# EAGLE design pcb_univ_3-102-0-x-rev3 (EAGLE 5.11)
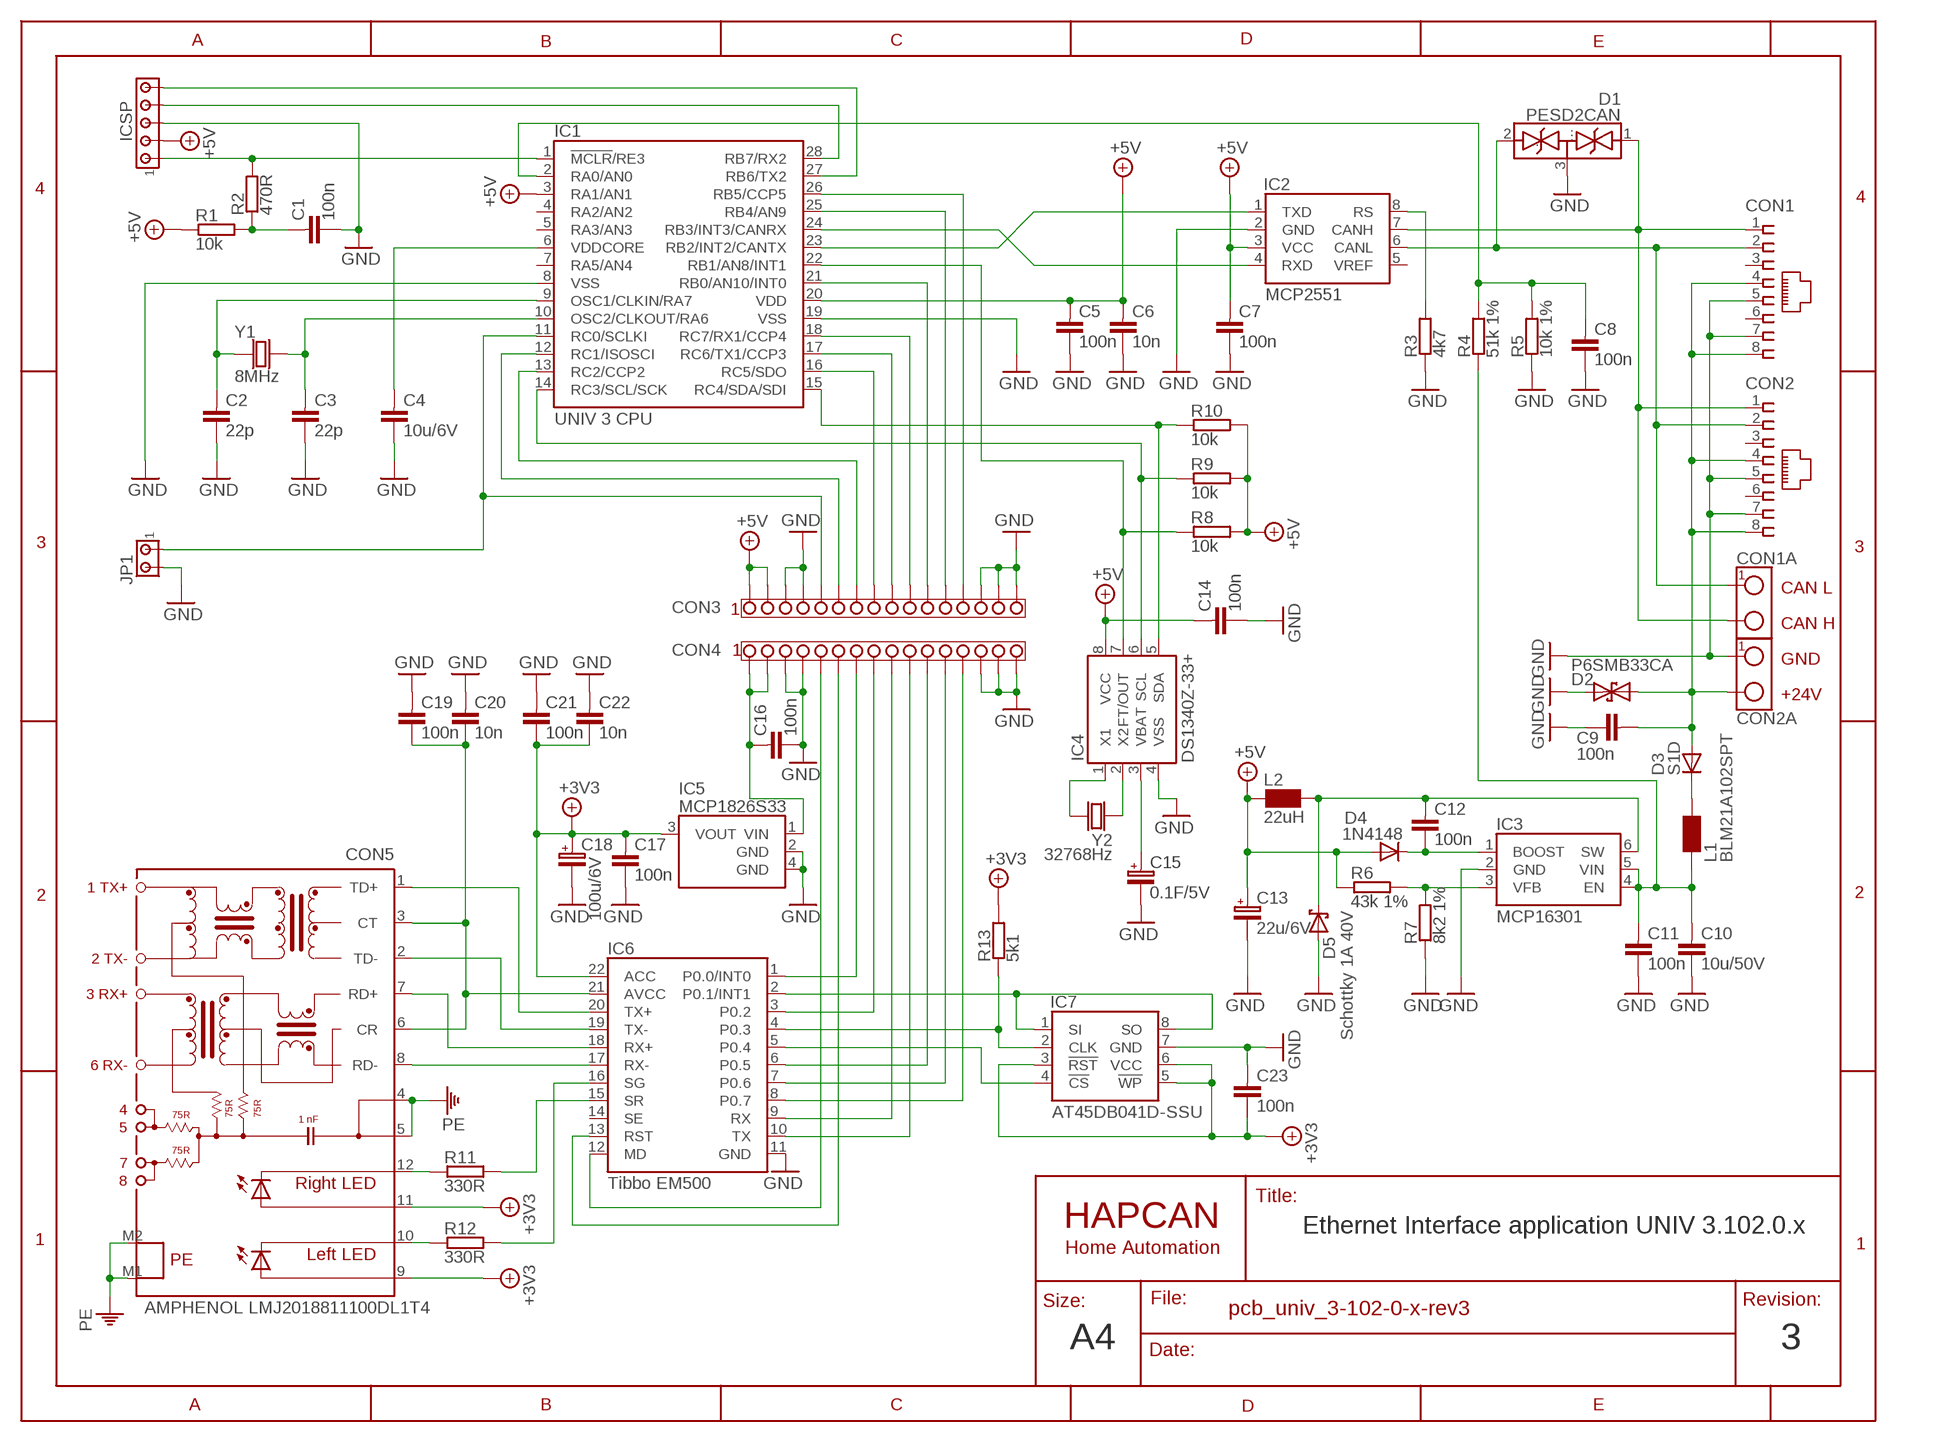
[diagram p0: schematic, sheet 1]

## Parts
C1  100n  CAPACITOR0805  [0805]
C2  22p  CAPACITOR0805  [0805]
C3  22p  CAPACITOR0805  [0805]
C4  10u/6V  CAPACITOR0805  [0805]
C5  100n  CAPACITOR0805  [0805]
C6  10n  CAPACITOR0805  [0805]
C7  100n  CAPACITOR0805  [0805]
C8  100n  CAPACITOR0805  [0805]
C9  100n  CAPACITOR0805  [0805]
C10  10u/50V  CAPACITOR1210  [1210]
C11  100n  CAPACITOR0805  [0805]
C12  100n  CAPACITOR0805  [0805]
C13  22u/6V  CAPACITOR-POLARIZED-SMC_B  [SMC_B]
C14  100n  CAPACITOR0805  [0805]
C15  0.1F/5V  CAPACITOR-POLARIZED-5X14  [CAP-5X14]
C16  100n  CAPACITOR0805  [0805]
C17  100n  CAPACITOR0805  [0805]
C18  100u/6V  CAPACITOR-POLARIZED-SMC_B  [SMC_B]
C19  100n  CAPACITOR0805  [0805]
C20  10n  CAPACITOR0805  [0805]
C21  100n  CAPACITOR0805  [0805]
C22  10n  CAPACITOR0805  [0805]
C23  100n  CAPACITOR0805  [0805]
CON1  RJ45-SOCKET  [RJ45-PCB-SOCKET]
CON1A  TERMINAL-2  TERMINAL-2-5X10,5MM  [ARK2-5X10,5MM]
CON2  RJ45-SOCKET  [RJ45-PCB-SOCKET]
CON2A  TERMINAL-2  TERMINAL-2-5X10,5MM  [ARK2-5X10,5MM]
CON3  16pin  CONNECTOR-16PINNORMAL  [CONNECTOR-16PIN]
CON4  16pin  CONNECTOR-16PINMIRRORED  [CONNECTOR-16PIN-REVERSED]
CON5  AMPHENOL LMJ2018811100DL1T4  RJ45-SOCKET-LMJ2018811100DL1T4  [RJ45-PCB-SOCKET+TRAFO]
D1  PESD2CAN  PESD2CANSOT-23  [SOT-23]
D2  P6SMB33CA  DIODE_TRANSIL  [DO-214_TRANSIL2]
D3  S1D  DIODE_DO-214  [DO-214]
D4  1N4148  DIODE_0805  [0805]
D5  Schottky 1A 40V  DIODE_TRANSIL1  [DO-214]
IC1  UNIV 3 CPU  UNIV3(CPU)  [UNIV3CPU]
IC2  MCP2551  [SO-08]
IC3  MCP16301  MCP16301SOT23-6  [SOT-23-6]
IC4  DS1340Z-33+  DS1340ZSO-08  [SO-08]
IC5  MCP1826S33  MCP1826SOT223-3  [SOT-223]
IC6  Tibbo EM500  EM500EM500  [EM500]
IC7  AT45DB041D-SSU  AT45DB041SO8  [SO-08]
ICSP  HEADER5  [SIP-5]
JP1  HEADER2  [SIP-2]
L1  BLM21A102SPT  CHOKE0805  [0805]
L2  22uH  CHOKEDL16  [CHOKE-DL16]
R1  10k  RESISTOR0805  [0805]
R2  470R  RESISTOR0805  [0805]
R3  4k7  RESISTOR0805  [0805]
R4  51k 1%  RESISTOR0805  [0805]
R5  10k 1%  RESISTOR0805  [0805]
R6  43k 1%  RESISTOR0805  [0805]
R7  8k2 1%  RESISTOR0805  [0805]
R8  10k  RESISTOR0805  [0805]
R9  10k  RESISTOR0805  [0805]
R10  10k  RESISTOR0805  [0805]
R11  330R  RESISTOR0805  [0805]
R12  330R  RESISTOR0805  [0805]
R13  5k1  RESISTOR0805  [0805]
Y1  8MHz  CRYSTALHC49V  [CRYSTAL-HC49V]
Y2  32768Hz  CRYSTALTC26H  [CRYSTAL-TC38H]

## Nets
+5V: C5.1 C6.1 C7.1 C13.+ C14.1 C17.1 C18.+ C21.2 C22.2 C23.2 CON3.1 CON3.2 CON5.9(C-L) CON5.11(C-R) D4.2(A) IC1.3(RA1/AN1) IC1.20(VDD) IC2.3(VCC) IC4.8(VCC) IC5.3(VOUT) IC6.22(ACC) IC7.3(!RST) IC7.5(!WP) IC7.6(VCC) ICSP.2 L2.1 R1.1 R6.1 R8.2 R9.2 R10.2 R13.2 ; supply symbol labelled +3V3
GND: C1.2 C2.2 C3.2 C4.2 C5.2 C6.2 C7.2 C8.2 C9.2 C10.2 C11.2 C13.- C14.2 C15.- C16.2 C17.2 C18.- C19.1 C20.1 C21.1 C22.1 C23.1 CON1.5 CON1.7 CON2.5 CON2.7 CON2A.1 CON3.3 CON3.4 CON3.14 CON3.15 CON3.16 CON4.3 CON4.4 CON4.14 CON4.15 CON4.16 D1.3(...) D2.C D5.A IC1.8(VSS) IC1.19(VSS) IC2.2(GND) IC3.2(GND) IC4.4(VSS) IC5.2(GND) IC5.4(GND) IC6.11(GND) IC7.7(GND) ICSP.3 JP1.2 R3.1 R5.1 R7.1
ICSP: IC1.1(!MCLR!/RE3) ICSP.1 R2.2
N$1: CON5.12(A-R) R11.1
N$2: IC1.24(RB3/INT3/CANRX) IC2.4(RXD)
N$3: IC1.23(RB2/INT2/CANTX) IC2.1(TXD)
N$4: CON5.10(A-L) R12.1
N$5: C12.1 D5.C IC3.6(SW) L2.2
N$6: IC3.3(VFB) R6.2 R7.2
N$7: C1.1 R1.2 R2.1
N$8: C8.1 IC1.2(RA0/AN0) R4.2 R5.2
N$9: CON1.1 CON1A.2 CON2.1 D1.1(.) IC2.7(CANH)
N$10: IC1.28(RB7/RX2) ICSP.4
N$11: C2.1 IC1.9(OSC1/CLKIN/RA7) Y1.1
N$12: IC2.8(RS) R3.2
N$13: CON1.2 CON1A.1 CON2.2 D1.2(..) IC2.6(CANL)
N$14: IC1.27(RB6/TX2) ICSP.5
N$15: C3.1 IC1.10(OSC2/CLKOUT/RA6) Y1.2
N$16: CON3.5 IC1.11(RC0/SCLKI) JP1.1
N$17: IC1.15(RC4/SDA/SDI) IC4.5(SDA) R10.1
N$18: C10.1 C11.1 IC3.4(EN) IC3.5(VIN) L1.1 R4.1
N$19: IC4.2(X2) Y2.1
N$20: IC6.16(SG) R12.2
N$21: IC6.15(SR) R11.2
N$22: C19.2 C20.2 CON5.3(CT) CON5.6(CR) IC6.21(AVCC)
N$23: CON5.7(RD+) IC6.18(RX+)
N$24: CON5.1(TD+) IC6.20(TX+)
N$25: CON5.8(RD-) IC6.17(RX-)
N$26: CON5.2(TD-) IC6.19(TX-)
N$27: CON4.5 IC6.12(MD)
N$28: C16.1 CON4.1 CON4.2 IC5.1(VIN)
N$29: CON3.9 IC1.17(RC6/TX1/CCP3)
N$30: CON3.8 IC1.16(RC5/SDO)
N$31: CON4.6 IC6.13(RST)
N$32: CON3.7 IC1.13(RC2/CCP2)
N$33: CON3.10 IC1.18(RC7/RX1/CCP4)
N$34: IC6.5(P0.4) IC7.4(!CS)
N$35: IC6.4(P0.3) IC7.2(CLK) R13.1
N$36: CON4.7 IC6.1(P0.0/INT0)
N$37: IC6.2(P0.1/INT1) IC7.1(SI) IC7.8(SO)
N$38: C12.2 D4.1(C) IC3.1(BOOST)
N$39: IC1.14(RC3/SCL/SCK) IC4.6(SCL) R9.1
N$40: CON4.8 IC6.3(P0.2)
N$41: CON4.9 IC6.9(RX)
N$42: CON4.10 IC6.10(TX)
N$43: CON4.11 IC6.6(P0.5)
N$44: CON4.12 IC6.7(P0.6)
N$45: CON4.13 IC6.8(P0.7)
N$47: CON3.6 IC1.12(RC1/ISOSCI)
N$49: IC4.1(X1) Y2.2
N$50: C15.+ IC4.3(VBAT)
N$51: CON3.11 IC1.21(RB0/AN10/INT0)
N$52: CON3.13 IC1.26(RB5/CCP5)
N$54: CON3.12 IC1.25(RB4/AN9)
N$55: IC1.22(RB1/AN8/INT1) IC4.7(FT/OUT) R8.1
N$56: C4.1 IC1.6(VDDCORE)
N$59: C9.1 CON1.4 CON1.8 CON2.4 CON2.8 CON2A.2 D2.A D3.A
N$61: D3.C L1.2
PE: CON5.4 CON5.5 CON5.M1 CON5.M2
Unconnected: CON1.3 CON1.6 CON2.3 CON2.6 IC1.4(RA2/AN2) IC1.5(RA3/AN3) IC1.7(RA5/AN4) IC2.5(VREF) IC6.14(SE)

## Notes on the sheet
- CAN L
- CON3 | 1
- CAN H
- CON4 | 1
- GND
- +24V
- Ethernet Interface application UNIV 3.102.0.x
- A4 | 3

## Library data of the parts
C1-C12 C14 C16 C17 C19-C23 = HAPCAN_devices - UNIV3:CAPACITOR: HAPCAN Capacitor
C13 C15 C18 = HAPCAN_devices - UNIV3:CAPACITOR-POLARIZED: HAPCAN Polarazied Capacitor
CON1 CON2 = HAPCAN_devices - UNIV3:RJ45-SOCKET: HAPCAN RJ45 socket
CON1A CON2A = HAPCAN_devices - UNIV3:TERMINAL-2: HAPCAN Terminal Block - 2 way
CON3 CON4 = HAPCAN_devices - UNIV3:CONNECTOR-16PIN: 16pin connector 2.54 raster
CON5 = HAPCAN_devices - UNIV3:RJ45-SOCKET-LMJ2018811100DL1T4: AMPHENOL LMJ2018811100DL1T4
D1 = HAPCAN_devices - UNIV3:PESD2CAN: CAN bus ESD protection diode
D2 = HAPCAN_devices - UNIV3:DIODE_TRANSIL: Transil diode
D3 D4 = HAPCAN_devices - UNIV3:DIODE: HAPCAN Rectifier Diode
D5 = HAPCAN_devices - UNIV3:DIODE_TRANSIL1: HAPCAN Unidirectional transil diode
IC1 = HAPCAN_devices - UNIV3:UNIV3(CPU): HAPCAN Microcontroller UNIV 3 (CPU)
IC2 = HAPCAN_devices - UNIV3:MCP2551: HAPCAN CAN Tranceiver
IC3 = HAPCAN_devices - UNIV3:MCP16301: High Voltage Input Integrated Switch Step-Down Regulator
IC4 = HAPCAN_devices - UNIV3:DS1340Z: DS1340Z
IC5 = HAPCAN_devices - UNIV3:MCP1826: 1000 mA, Low Voltage, Low Quiescent Current LDO Regulator
IC6 = HAPCAN_devices - UNIV3:EM500: Tibbo programmable ethernet module
IC7 = HAPCAN_devices - UNIV3:AT45DB041
ICSP = HAPCAN_devices - UNIV3:HEADER5: HAPCAN Header 5
JP1 = HAPCAN_devices - UNIV3:HEADER2: HAPCAN Header 2
L1 L2 = HAPCAN_devices - UNIV3:CHOKE: Choke
R1-R13 = HAPCAN_devices - UNIV3:RESISTOR: HAPCAN Resistor
Y1 Y2 = HAPCAN_devices - UNIV3:CRYSTAL: HAPCAN Crystal

## Board
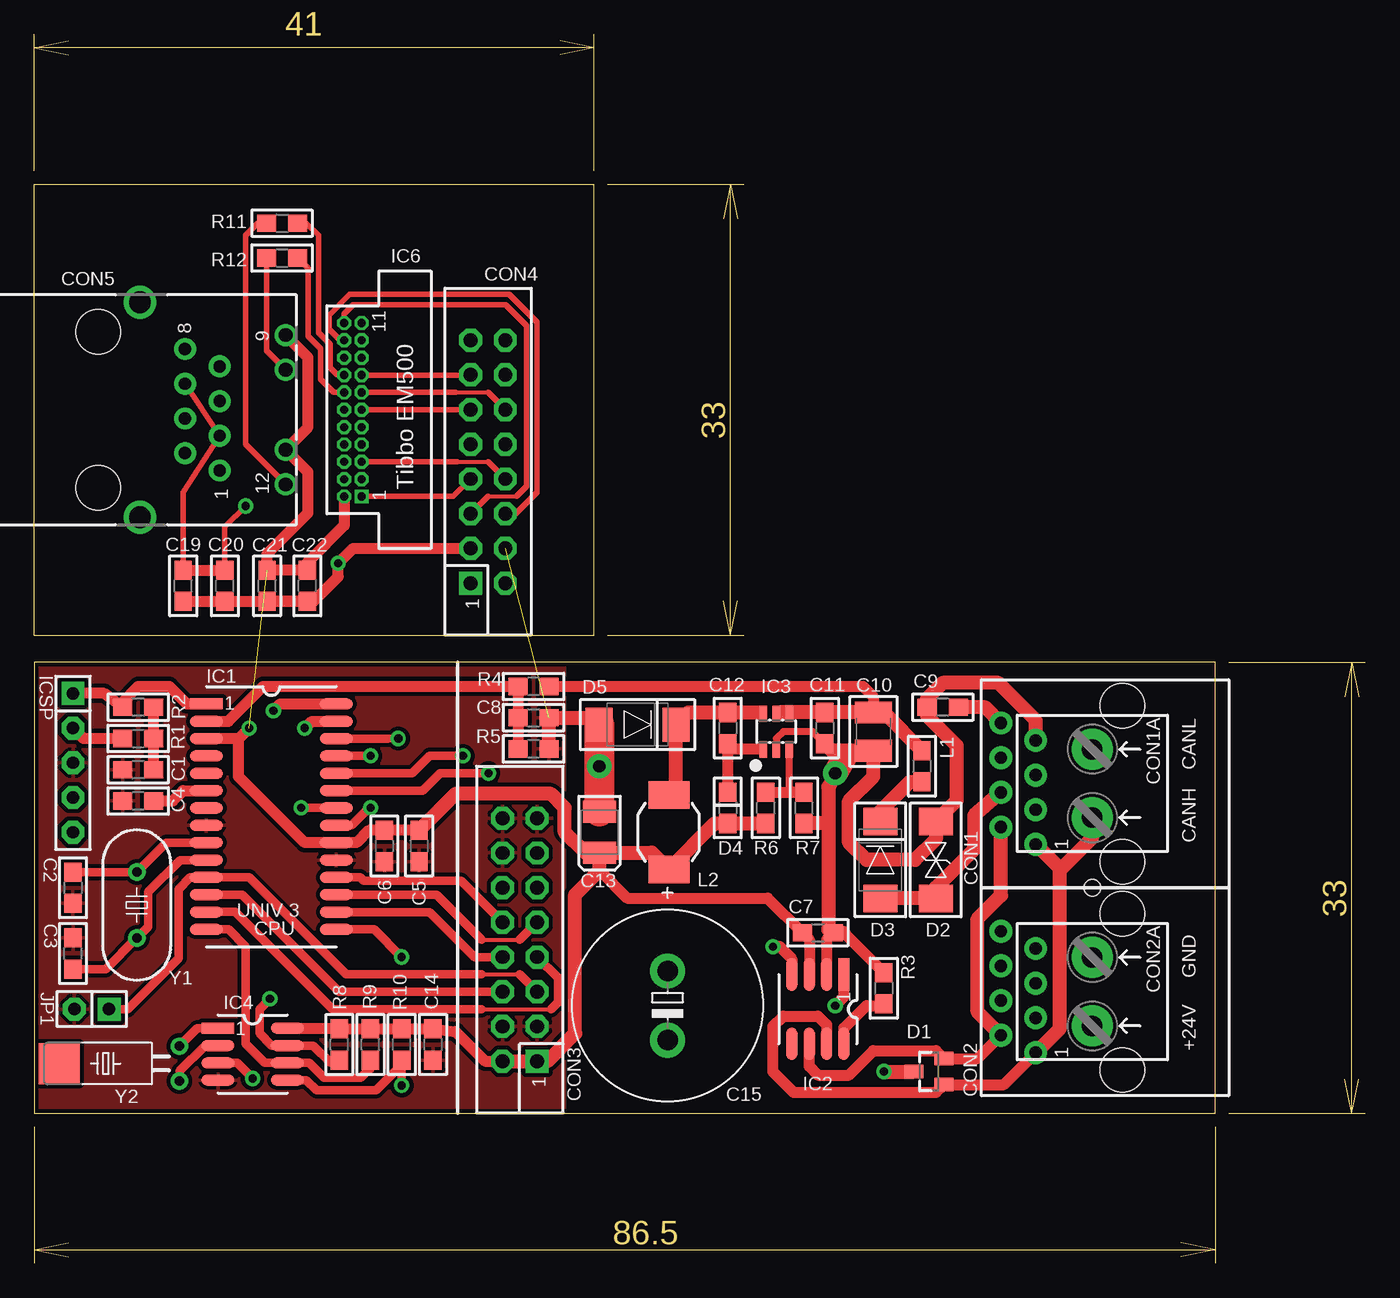
[diagram p1: board, top side]
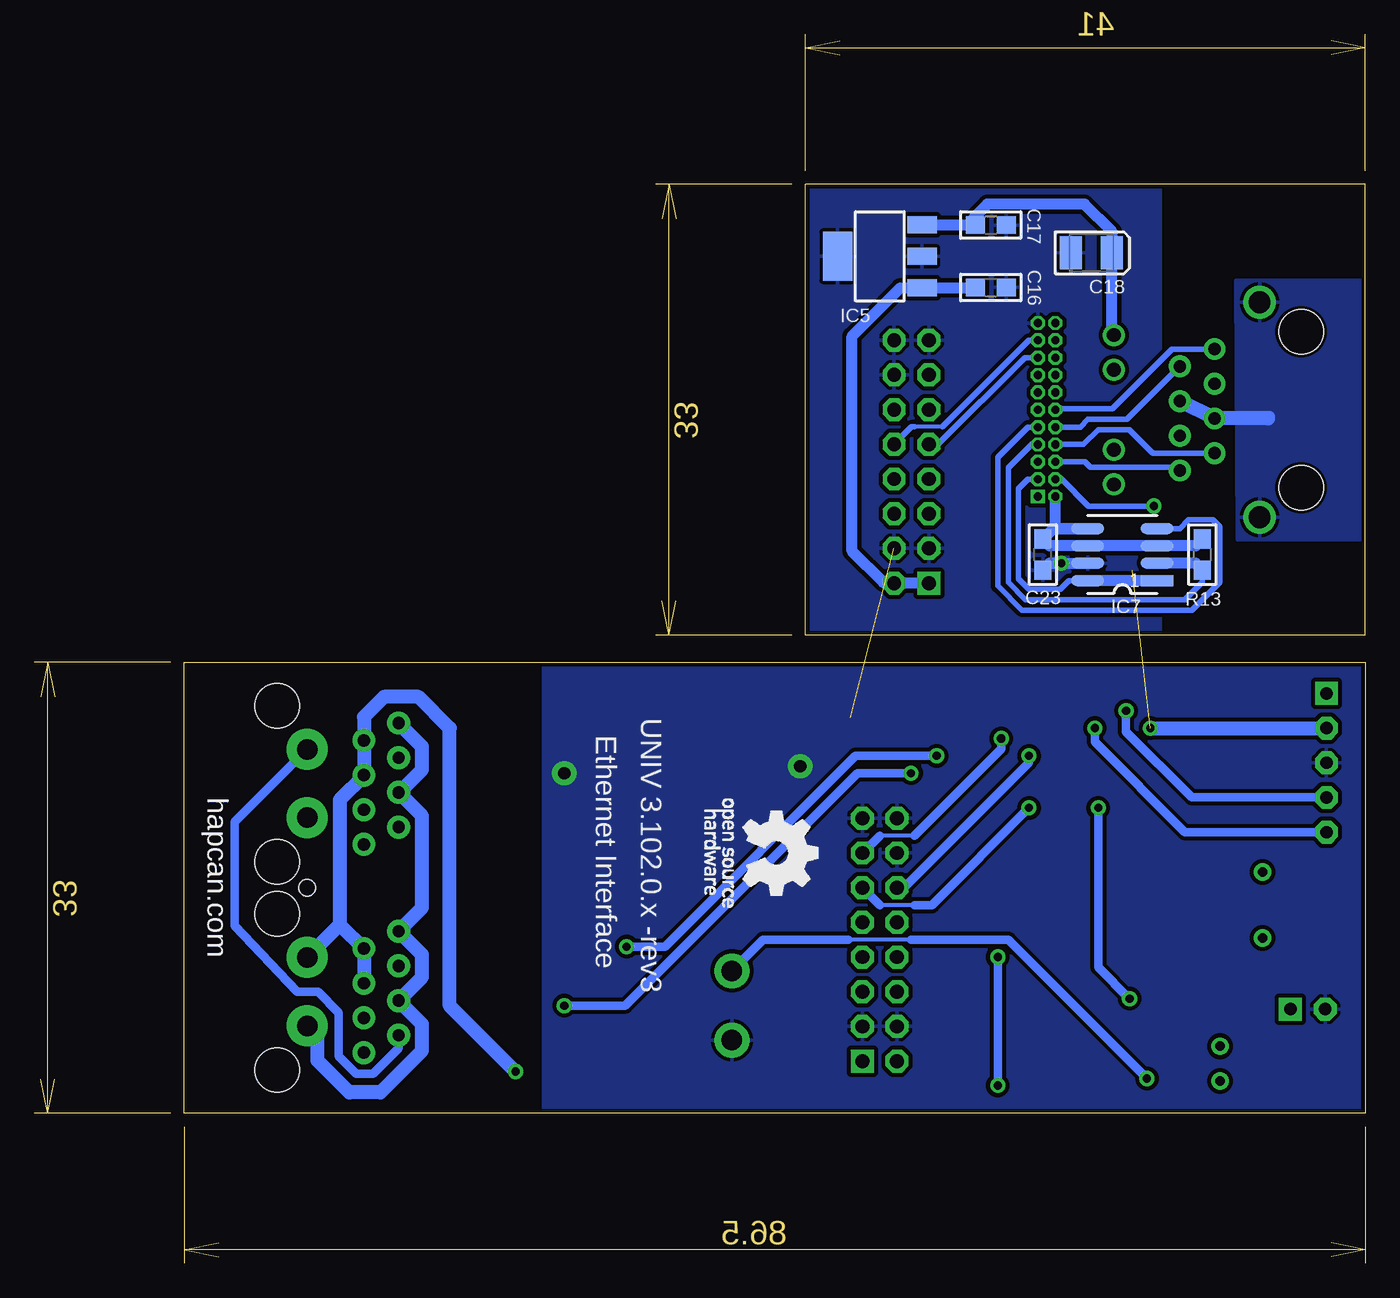
[diagram p2: board, bottom side, seen from below]

Size 97.5 x 90 mm. Coordinates in mm from the lower left corner, seen from the top.
Outline: 0,10 0,1
Outline: 0,1 0,0
Outline: 86.5,10 86.5,1
Outline: 86.5,1 86.5,0
Outline: 0,1 86.5,1
Outline: 86.5,1 84,1.5
Outline: 86.5,1 84,0.5
Outline: 0,1 2.5,1.5
Outline: 0,1 2.5,0.5
Outline: 41,80 41,89
Outline: 41,89 41,90
Outline: 0,80 0,89
Outline: 0,89 0,90
Outline: 41,89 0,89
Outline: 0,89 2.5,88.5
Outline: 0,89 2.5,89.5
Outline: 41,89 38.5,88.5
Outline: 41,89 38.5,89.5
Outline: 42,46 51,46
Outline: 51,46 52,46
Outline: 42,79 51,79
Outline: 51,79 52,79
Outline: 51,46 51,79
Outline: 51,79 50.5,76.5
Outline: 51,79 51.5,76.5
Outline: 51,46 50.5,48.5
Outline: 51,46 51.5,48.5
Outline: 87.5,11 96.5,11
Outline: 96.5,11 97.5,11
Outline: 87.5,44 96.5,44
Outline: 96.5,44 97.5,44
Outline: 96.5,11 96.5,44
Outline: 96.5,44 96,41.5
Outline: 96.5,44 97,41.5
Outline: 96.5,11 96,13.5
Outline: 96.5,11 97,13.5
Outline: 86.5,11 86.5,44 0,44 0,11 86.5,11
Outline: 0,46 41,46 41,79 0,79 0,46
Copper layers (1*16): Top 0.035mm / dielectric 1.5mm / Bottom 0.035mm
Design rules "HAPCAN-Drc *": minimum track width 10mil, minimum drill 0.5mm, track to track 10mil, track to pad 10mil, pad to pad 10mil, via to via 10mil, smd to smd 0mil, copper to edge 10mil, drill to drill 8mil, minimum pad ring 8mil, minimum via ring 10mil, stop-mask expansion 4mil, vias tented up to drill 0mil, thermal gap 10mil
Holes 1.2 mm at 77.5,27.5
tKeepout: 4 lines

### Footprints (pad centres in the part's own frame; a part is rotated, then mirrored left to right if it is on the bottom)
0805 = smd 1.397 x 1.27: 1 -1.143,0; 2 1.143,0
1210 = smd 1.6 x 2.7: 1 -1.4,0; 2 1.4,0
SMC_B = smd 1.6 x 2.4: + -1.5,0; - 1.5,0
CAP-5X14 = drill 1.5 pad 2.54 round: + -2.54,0; - 2.54,0
RJ45-PCB-SOCKET@1 = drill 0.9 pad 1.676 round: 1 -4.445,6.35; 2 -3.175,8.89; 3 -1.905,6.35; 4 -0.635,8.89; 5 0.635,6.35; 6 1.905,8.89; 7 3.175,6.35; 8 4.445,8.89 | hole 3.251: -5.715,0; 5.715,0
ARK2-5X10,5MM = drill 1.5 pad 3 round: 1 -2.5,0; 2 2.5,0
CONNECTOR-16PIN = drill 1.016 pad 1.676 square: 1 -8.89,-1.27 | drill 1.016 pad 1.676 octagon: 2 -8.89,1.27; 3 -6.35,-1.27; 4 -6.35,1.27; 5 -3.81,-1.27; 6 -3.81,1.27; 7 -1.27,-1.27; 8 -1.27,1.27; 9 1.27,-1.27; 10 1.27,1.27; 11 3.81,-1.27; 12 3.81,1.27; 13 6.35,-1.27; 14 6.35,1.27; 15 8.89,-1.27; 16 8.89,1.27
CONNECTOR-16PIN-REVERSED = drill 1.016 pad 1.676 square: 1 -8.89,1.27 | drill 1.016 pad 1.676 octagon: 2 -8.89,-1.27; 3 -6.35,1.27; 4 -6.35,-1.27; 5 -3.81,1.27; 6 -3.81,-1.27; 7 -1.27,1.27; 8 -1.27,-1.27; 9 1.27,1.27; 10 1.27,-1.27; 11 3.81,1.27; 12 3.81,-1.27; 13 6.35,1.27; 14 6.35,-1.27; 15 8.89,1.27; 16 8.89,-1.27
RJ45-PCB-SOCKET+TRAFO = drill 0.9 pad 1.6 round: 1 4.445,6.35; 2 3.175,3.81; 3 1.905,6.35; 4 0.635,3.81; 5 -0.635,6.35; 6 -1.905,3.81; 7 -3.175,6.35; 8 -4.445,3.81 | drill 1 pad 1.6 round: 9 -5.465,11.18; 10 -2.925,11.18; 11 2.925,11.18; 12 5.465,11.18 | drill 1.6 pad 2.3 round: M1 -7.875,0.51; M2 7.875,0.51 | hole 3.25: 5.715,-2.54; -5.715,-2.54
SOT-23 = smd 1 x 1.4: 1 -0.95,-1.1; 2 0.95,-1.1; 3 0,1.1
DO-214_TRANSIL2@1 = smd 2 x 2.5: A 2.82,0; C -2.82,0
DO-214 = smd 2 x 2.5: A 2.82,0; C -2.82,0
UNIV3CPU@1 = smd 2.4 x 0.8: 1 -4.763,8.255; 2 -4.763,6.985; 3 -4.763,5.715; 4 -4.763,4.445; 5 -4.763,3.175; 6 -4.763,1.905; 7 -4.763,0.635; 8 -4.763,-0.635; 9 -4.763,-1.905; 10 -4.763,-3.175; 11 -4.763,-4.445; 12 -4.763,-5.715; 13 -4.763,-6.985; 14 -4.763,-8.255; 15 4.763,-8.255; 16 4.763,-6.985; 17 4.763,-5.715; 18 4.763,-4.445; 19 4.763,-3.175; 20 4.763,-1.905; 21 4.763,-0.635; 22 4.763,0.635; 23 4.763,1.905; 24 4.763,3.175; 25 4.763,4.445; 26 4.763,5.715; 27 4.763,6.985; 28 4.763,8.255
SO-08 = smd 2.4 x 0.8: 1 -2.54,1.905; 2 -2.54,0.635; 3 -2.54,-0.635; 4 -2.54,-1.905; 5 2.54,-1.905; 6 2.54,-0.635; 7 2.54,0.635; 8 2.54,1.905
SOT-23-6 = smd 0.55 x 1.2: 1 -0.95,-1.3; 2 0,-1.3; 3 0.95,-1.3; 4 0.95,1.3; 5 0.003,1.3; 6 -0.95,1.3
SOT-223 = smd 1.27 x 2.159: 1 -2.311,-3.099; 2 0,-3.099; 3 2.311,-3.099 | smd 3.556 x 2.159: 4 0,3.099
EM500 = drill 0.6 pad 1.016 square: 1 -6.35,1.27 | drill 0.6 pad 1.016 octagon: 2 -5.08,1.27; 3 -3.81,1.27; 4 -2.54,1.27; 5 -1.27,1.27; 6 0,1.27; 7 1.27,1.27; 8 2.54,1.27; 9 3.81,1.27; 10 5.08,1.27; 11 6.35,1.27; 12 6.35,2.54; 13 5.08,2.54; 14 3.81,2.54; 15 2.54,2.54; 16 1.27,2.54; 17 0,2.54; 18 -1.27,2.54; 19 -2.54,2.54; 20 -3.81,2.54; 21 -5.08,2.54; 22 -6.35,2.54
SIP-5 = drill 0.9 pad 1.676 square: 1 -5.08,0 | drill 0.9 pad 1.676 octagon: 2 -2.54,0; 3 0,0; 4 2.54,0; 5 5.08,0
SIP-2 = drill 0.9 pad 1.676 square: 1 -1.27,0 | drill 0.9 pad 1.676 octagon: 2 1.27,0
CHOKE-DL16 = smd 2 x 3: 1 -2.73,0; 2 2.73,0
CRYSTAL-HC49V = drill 0.7 pad 1.27 round: 1 -2.413,0; 2 2.413,0
CRYSTAL-TC38H = drill 0.7 pad 1.27 round: 1 -1.27,-5; 2 1.27,-5 | smd 3 x 3: 3 0,3.8

### Placement (x,y rotation side)
C1  7.62,36.15 180 top
C2  2.84,27.51 270 top
C3  2.84,22.69 90 top
C4  7.62,33.86 180 top
C5  28.19,30.56 270 top
C6  25.65,30.56 270 top
C7  57.4,24.21 0 top
C8  36.58,39.96 0 top
C9  66.55,40.72 180 top
C10  61.47,38.94 270 top
C11  57.91,39.19 270 top
C12  50.8,39.19 270 top
C13  41.4,31.57 90 top
C14  29.21,16.03 270 top
C15  46.39,18.88 270 top
C16  27.43,71.45 0 bottom
C17  27.43,76.02 0 bottom
C18  20.07,73.99 180 bottom
C19  10.92,49.61 90 top
C20  13.97,49.61 90 top
C21  17.07,49.61 90 top
C22  20.02,49.61 90 top
C23  23.62,51.89 90 bottom
CON1  [RJ45-PCB-SOCKET@1]  79.7,35.12 90 top
CON1A  77.5,35.14 270 top
CON2  [RJ45-PCB-SOCKET@1]  79.7,19.88 90 top
CON2A  77.5,19.9 270 top
CON3  35.57,23.7 90 top
CON4  33.24,58.7 90 top
CON5  7.24,62.5 270 top
D1  65.53,14.05 90 top
D2  P6SMB33CA  [DO-214_TRANSIL2@1]  66.04,29.54 270 top
D3  61.98,29.54 270 top
D4  50.8,33.35 270 top
D5  44.2,39.45 180 top
IC1  UNIV 3 CPU  [UNIV3CPU@1]  17.37,32.71 0 top
IC2  57.4,18.62 270 top
IC3  54.36,38.94 0 top
IC4  16,15.32 0 top
IC5  35.56,73.74 90 bottom
IC6  25.25,62.5 90 top
IC7  17.79,51.9 180 bottom
ICSP  2.84,36.65 270 top
JP1  4.22,18.62 180 top
L1  65.02,36.4 270 top
L2  46.48,31.57 90 top
R1  7.62,38.43 0 top
R2  7.62,40.72 180 top
R3  62.23,20.14 270 top
R4  36.58,42.24 180 top
R5  36.58,37.67 180 top
R6  53.59,33.35 90 top
R7  56.39,33.35 90 top
R8  22.35,16.03 90 top
R9  24.64,16.03 90 top
R10  26.92,16.03 90 top
R11  18.16,76.15 0 top
R12  18.16,73.61 0 top
R13  11.94,51.89 90 bottom
Y1  7.52,26.24 270 top
Y2  5.64,14.63 90 top

### Tracks (layer width: path | path; a pad name or v marks a point on that pad's centre or on a via)
+5V  (via drill 0.6 pad 1.02)  (1 unrouted)
  Top 0.813: R1.1 3.61,38.43 ICSP.2 | CON3.2 33.02,14.81 30.86,16.97 C14.1 R10.2 R9.2 R8.2 22.1,17.22 IC4.8 | C5.1 C6.1 24.51,31.7 23.61,30.8 IC1.20 19.82,30.8 14.98,35.65 14.98,38.42 | 14.98,38.42 IC1.3 | 14.98,38.42 v15.75,39.19 | IC2.3 56.77,23.7 C7.1 53.72,26.75 43.43,26.75 41.4,28.78 | CON5.9 20.07,66.32 20.07,61.22 CON5.11 20.07,57.93 20.07,54.94 17.07,51.94 C21.2 | C21.2 C22.2 20.07,50.8 20.07,51.39 22.71,54.03 IC6.22 | C21.2 17.07,50.8
  Top 1.016: R6.1 D4.2 49.85,32.21 L2.1 45.25,30.07 C13.+ | C5.1 30.86,34.37 37.85,34.37 38.86,33.35 38.86,31.57 40.39,30.05 41.38,30.05 C13.+ | C13.+ 41.4,28.78 39.62,27 39.62,16.84 37.59,14.81 CON3.1 CON3.2
  Bottom 0.813: IC5.3 32.49,76.05 32.51,76.02 C17.1 28.57,76.53 28.7,76.53 27.69,77.55 20.57,77.55 18.54,75.52 18.54,74.02 C18.+ 18.57,68.11 CON5.9 | R13.2 12.44,52.53 IC7.3 IC7.6 23.12,52.53 C23.2 22.86,53.8 IC7.5 22.71,53.8 IC6.22
  Bottom 1.016: v15.75,39.19 ICSP.2
GND  (via drill 0.6 pad 1.02, 0.9 pad 1.78)  (1 unrouted)
  Top 0.508: IC3.2 54.36,38.43 54.86,38.94 57.02,38.94 C11.2
  Top 0.61: v41.4,36.4 41.01,37.3 41.01,39.82
  Top 0.813: IC2.2 58.04,23.7 C7.2 59.31,24.21 R3.1 | C19.1 C20.1 C22.1 C21.1 20.46,48.47 22.28,50.28 v22.28,51.26 23.37,52.35 CON4.3
  Top 1.016: v62.23,14.05 D1.3 | R5.1 C8.2 40.87,39.96 41.01,39.82 D5.A | CON1.7 73.35,39.76 70.61,42.5 66.55,42.5 65.41,41.35 C9.2 65.41,40.08 67.56,37.92 67.56,33.89 D2.C 66.04,31.07 64.52,29.54 60.96,29.54 59.69,30.81 59.69,33.86 61.47,35.64 C10.2 59.69,37.54 | 59.69,37.54 58.42,37.54 C11.2 | 59.31,24.21 58.42,24.21 58.17,24.46 58.17,32.08 | 58.17,32.08 58.17,34.88 v58.67,35.89 | 59.69,37.54 59.44,37.16 | R7.1 58.04,32.21 58.17,32.08
  Top 1.778: 59.44,37.16 v58.67,35.89
  Top 2.184: D5.A 41.38,33.1 C13.-
  Bottom 0.813: 22.86,51.26 IC7.7 | 22.86,51.26 23.11,51.26 C23.1 | v22.28,51.26 22.86,51.26 arc90 22.86,51.26
  Bottom 1.016: CON2.5 CON2.7 75.11,24.81 | 75.11,24.81 75.11,33.94 73.35,35.69 CON1.5 CON1.7 73.35,40.01 71.88,41.48 69.34,41.48 67.06,39.19 67.06,18.87 v62.23,14.05 | CON2A.1 75.11,24.79 75.11,24.81
  pour Top (isolate 0.305): 0,11 38.86,11 38.86,44.02 0,44.02
  pour Bottom (isolate 0.305): 0,11 60.2,11 60.2,44.02 0,44.02
  pour Bottom (isolate 0.305): 41,46 41,79 15,79 15,46
ICSP
  Top 0.813: ICSP.1 5.13,41.73 R2.2 6.48,41.1 7.62,42.24 9.91,42.24 11.19,40.96 IC1.1
N$1
  Top 0.406: CON5.12 15.49,59.96 15.49,75.26 16.38,76.15 R11.1
N$2  (via drill 0.6 pad 1.02)
  Top 0.61: IC1.24 27.68,35.88 28.96,37.16 v31.39,37.16
  Top 0.813: IC2.4 55.5,22.3 54.61,23.19 v54.1,23.19
  Bottom 0.61: v31.39,37.16 37.34,37.16 51.31,23.19 v54.1,23.19
N$3  (via drill 0.6 pad 1.02)
  Top 0.61: IC1.23 28.44,34.61 29.72,35.89 v33.27,35.89
  Top 0.813: IC2.1 59.31,19.51 v58.67,18.87
  Bottom 0.61: v33.27,35.89 37.21,35.89 54.23,18.87 v58.67,18.87
N$4
  Top 0.406: CON5.10 17.02,66.83 R12.1
N$5
  Top 0.254: 53.16,40.34 53.31,40.34 IC3.6
  Top 1.016: L2.2 47.02,34.84 D5.C 47.91,40.34 C12.1 53.16,40.34
N$6
  Top 0.508: 55.31,34.56 IC3.3
  Top 0.813: R6.2 55.63,34.5 | 55.63,34.5 R7.2 | 55.63,34.5 55.31,34.56
N$7
  Top 0.813: R2.1 R1.2 C1.1
N$8
  Top 0.813: R5.2 C8.1 R4.2 16.76,42.24 14.21,39.69 IC1.2
N$9
  Top 0.813: CON2.1 71.01,13.1 D1.1 66.06,12.52 55.63,12.52 54.1,14.05 54.1,17.35 54.86,18.11 57.4,18.11 58.04,17.48 IC2.7
  Top 1.016: CON2.1 75.11,17.19 75.11,28.78 | 75.11,28.78 75.11,28.92 CON1.1 | CON1A.2 77.5,31.17 75.11,28.78
N$10  (via drill 0.6 pad 1.02)
  Top 0.813: IC1.28 18.02,40.96 v17.53,40.46
  Bottom 0.61: ICSP.4 12.7,34.11 17.53,38.94 v17.53,40.46
N$11
  Top 0.61: IC1.9 9.67,30.8 Y1.1 C2.1
N$12
  Top 0.813: IC2.8 59.31,17.22 60.96,18.87 62.1,18.87 R3.2
N$13
  Top 0.813: CON2.2 69.1,15 D1.2 66.06,15.57 61.47,15.57 59.69,13.79 57.4,13.79 56.77,14.43 IC2.6
  Top 1.016: CON2.2 69.09,18.43 69.09,25.22 70.81,26.95 CON1.2
  Bottom 0.61: CON2.2 70.81,15.75 72.67,13.9 73.91,13.9 75.18,15.17 75.18,18.37 76.71,19.89 78.23,19.89 82.8,24.72 82.8,32.34 CON1A.1
N$14  (via drill 0.6 pad 1.02)
  Top 0.813: IC1.27 20.33,39.69 v19.81,39.19
  Bottom 0.61: ICSP.5 13.21,31.57 19.81,38.18 v19.81,39.19
N$15
  Top 0.61: IC1.10 10.68,29.53 8.36,27.2 8.36,24.66 Y1.2 5.24,21.55 C3.1
N$16
  Top 0.305: 32.77,21.16 35.57,21.16
  Top 0.61: 35.57,21.16 CON3.5 | 32.77,21.16 22.86,21.16 15.76,28.26 IC1.11 11.45,28.26 10.59,27.41 10.59,22.35 6.86,18.62 JP1.1
N$17  (via drill 0.6 pad 1.02)
  Top 0.61: IC4.5 19.94,13.41 20.68,12.68 25.04,12.68 26.92,14.56 R10.1 v26.92,13.03 | IC1.15 24.9,24.45 v26.92,22.43
  Bottom 0.61: v26.92,13.03 v26.92,22.43
N$18
  Top 0.254: IC3.5 IC3.4
  Top 0.813: R4.1 60.71,42.24 61.47,41.48 C10.1
  Top 1.016: IC3.4 54.64,40.34 C11.1 57.66,40.34 C10.1 62.23,40.34 L1.1
N$19
  Top 0.61: IC4.2 12.52,15.95 10.66,14.1 Y2.1
N$20
  Top 0.406: IC6.16 22.45,63.78 21.92,63.78 20.98,64.72 20.98,66.98 20.07,67.9 20.07,72.85 R12.2
N$21
  Top 0.406: IC6.15 22.45,65.05 22.17,65.05 21.67,65.56 21.67,67.29 20.83,68.12 20.83,75.26 19.94,76.15 R11.2
N$22  (via drill 0.6 pad 1.02)
  Top 0.406: CON5.6 CON5.3 10.92,56.47 C19.2 | v15.49,55.45 13.97,53.93 C20.2
  Top 0.813: C19.2 C20.2
  Bottom 0.406: IC6.21 22.28,57.43 20.3,55.45 v15.49,55.45
N$23
  Bottom 0.406: IC6.18 20.89,61.23 20.32,61.8 17.46,61.8 CON5.7
N$24
  Bottom 0.406: CON5.1 13.83,58.3 20.14,58.3 20.54,58.69 IC6.20
N$25
  Bottom 0.406: CON5.8 14.16,66.94 18.54,62.56 22.65,62.56 IC6.17
N$26
  Bottom 0.406: IC6.19 20.64,59.96 19.56,61.04 17.27,61.04 15.56,59.33 CON5.2
N$27
  Top 0.305: 33.24,56.16 35.33,56.16
  Top 0.406: IC6.12 22.71,69.53 23.37,70.18 34.54,70.18 36.07,68.66 36.07,56.9 35.33,56.16 | CON4.5 33.24,56.16
N$28
  Bottom 0.813: CON4.1 CON4.2 34.56,49.86 35.31,49.86 37.59,52.15 37.59,67.9 34.06,71.43 IC5.1 28.6,71.43 C16.1
N$29
  Top 0.305: 32.77,23.7 35.57,23.7
  Top 0.61: IC1.17 29.47,26.99 32.77,23.7 | 35.57,23.7 CON3.9
N$30
  Top 0.61: CON3.8 32.26,22.43 28.96,25.72 IC1.16
N$31
  Top 0.406: IC6.13 22.41,67.58 21.59,68.4 21.59,69.42 23.11,70.94 34.8,70.94 36.83,68.91 36.83,56.47 35.25,54.89 CON4.6
N$32
  Top 0.305: 32.77,18.62 37.85,18.62
  Top 0.61: CON3.7 38.35,20.92 38.35,19.13 37.85,18.62 | IC1.13 12.62,25.73 14.73,25.73 21.84,18.62 32.77,18.62
N$33
  Top 0.61: IC1.18 23.89,28.26 24.13,28.02 31.25,28.02 CON3.10
N$34
  Bottom 0.406: IC6.5 24.7,61.23 26.92,59.01 26.92,49.61 25.15,47.83 12.7,47.83 10.67,49.86 10.67,53.93 11.18,54.43 12.95,54.43 13.59,53.8 IC7.4
N$35
  Bottom 0.406: IC6.4 24.05,60.02 24.38,60.02 26.16,58.24 26.16,49.86 24.89,48.59 13.21,48.59 11.94,49.86 R13.1
  Bottom 0.813: IC7.2 12.45,51.26 R13.1
N$36
  Top 0.406: CON4.7 30.69,56.15 IC6.1
N$37
  Bottom 0.406: IC7.8 21.71,49.99 22.35,49.35 24.64,49.35 25.4,50.12 25.4,56.72 24.7,57.42 IC6.2
  Bottom 0.813: IC7.1 IC7.8
N$38
  Top 0.254: IC3.1 53.12,37.64 53.09,37.67
  Top 0.813: D4.1 C12.2 51.18,37.67 53.09,37.67
N$39
  Top 0.61: R9.1 24.64,14.3 23.93,13.59 21.23,13.59 20.14,14.68 IC4.6 16.89,14.68 15.49,16.08 15.49,23.19 14.23,24.45 IC1.14
N$40
  Top 0.305: 30.99,58.7 33.24,58.7
  Top 0.406: 33.24,58.7 CON4.8 | 30.99,58.7 24,58.7 arc90 IC6.3
N$41
  Bottom 0.406: IC6.9 24.95,66.31 31.29,59.97 CON4.9
N$42
  Bottom 0.305: 30.99,61.24 33.05,61.24
  Bottom 0.406: CON4.10 33.24,61.24 33.05,61.24 | 30.99,61.24 24.65,67.58 IC6.10
N$43
  Top 0.406: IC6.6 23.99,62.51 CON4.11
N$44
  Top 0.305: 30.86,63.78 33.24,63.78
  Top 0.406: 33.24,63.78 CON4.12 | 30.86,63.78 24,63.78 arc90 IC6.7
N$45
  Top 0.406: IC6.8 CON4.13
N$47
  Top 0.61: CON3.6 22.35,19.89 15.25,26.99 IC1.12
N$49
  Top 0.61: IC4.1 11.96,17.22 Y2.2
N$50  (via drill 0.6 pad 1.02)
  Top 0.61: IC4.3 14.86,14.68 v16,13.54
  Bottom 0.305: 33.27,23.7 37.85,23.7
  Bottom 0.61: v16,13.54 26.16,23.7 33.27,23.7 | C15.+ 44.11,23.7 37.85,23.7
N$51  (via drill 0.6 pad 1.02)
  Top 0.61: IC1.21 23.26,32.07 24.54,33.35 v24.64,33.35
  Bottom 0.305: 33.02,26.24 35.57,26.24
  Bottom 0.61: v24.64,33.35 31.75,26.24 33.02,26.24 | 35.57,26.24 CON3.11
N$52  (via drill 0.6 pad 1.02)
  Top 0.61: IC1.26 25.9,38.42 v26.67,38.43
  Bottom 0.305: 33.02,31.32 35.57,31.32
  Bottom 0.61: 35.57,31.32 CON3.13 | v26.67,38.43 26.67,37.67 33.02,31.32
N$54  (via drill 0.6 pad 1.02)
  Top 0.61: IC1.25 v24.63,37.15 v24.64,37.16
  Bottom 0.61: v24.64,37.16 24.64,36.65 33.78,27.51 CON3.12
N$55  (via drill 0.6 pad 1.02)
  Top 0.61: R8.1 21.72,14.68 20.45,15.95 IC4.7 17.4,15.95 16.51,16.84 16.51,18.62 v17.27,19.38 | IC1.22 22.13,33.35 v19.56,33.35
  Bottom 0.61: v17.27,19.38 19.56,21.67 v19.56,33.35
N$56
  Top 0.813: IC1.6 10.91,34.61 10.16,33.86 C4.1
N$59
  Top 1.016: D3.A D2.A 66.04,27.51 68.83,30.3 68.83,32.76 CON1.4 | C9.1 69.66,40.72 CON1.8
  Bottom 1.016: CON1.8 69.09,37.84 69.09,36.15 70.75,34.48 CON1.4 69.09,32.76 69.09,26.05 CON2.8 69.09,22.6 69.09,20.97 CON2.4 69.09,17.52 69.09,15.57 72.14,12.52 74.42,12.52 76.74,14.84 76.74,16.64 CON2A.2
N$61
  Top 1.016: L1.2 64.14,35.26 61.98,33.1 D3.C
PE
  Bottom 0.813: 7.13,61.87 7,62
  Bottom 1.016: CON5.5 CON5.4 7.13,61.87
  pour Bottom: 0,72 0,53 9.38,53 9.48,72

### Text on the board
Dimension: 41 | 33 | 33 | 86.5
tPlace: CANL | CANH | GND | +24V
bPlace: UNIV 3.102.0.x -rev3 | Ethernet Interface | hapcan.com
tKeepout: Eagle Light Keep Out Size